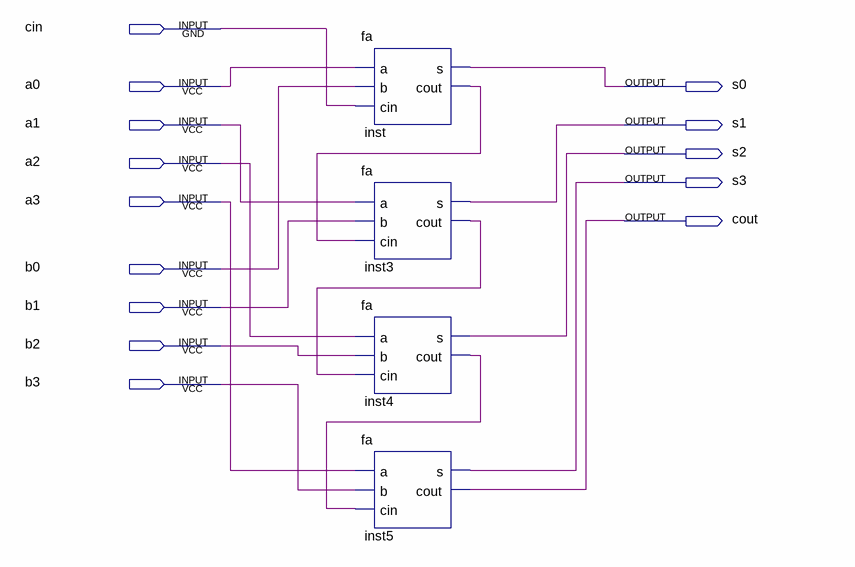
[diagram p0: schematic sheet]
// Quartus schematic 4sum.bdf as structural Verilog: 4 symbols, 14 pins
module \4sum  (
  input  cin,
  input  a0,
  input  a1,
  input  a2,
  input  a3,
  input  b0,
  input  b1,
  input  b2,
  input  b3,
  output s0,
  output s1,
  output s2,
  output s3,
  output cout
);

  wire inst3_cout, inst4_cout, inst_cout;

  fa inst (.a(a0), .b(b0), .cin(cin), .s(s0), .cout(inst_cout));
  fa inst3 (.a(a1), .b(b1), .cin(inst_cout), .s(s1), .cout(inst3_cout));
  fa inst4 (.a(a2), .b(b2), .cin(inst3_cout), .s(s2), .cout(inst4_cout));
  fa inst5 (.a(a3), .b(b3), .cin(inst4_cout), .s(s3), .cout(cout));
endmodule
